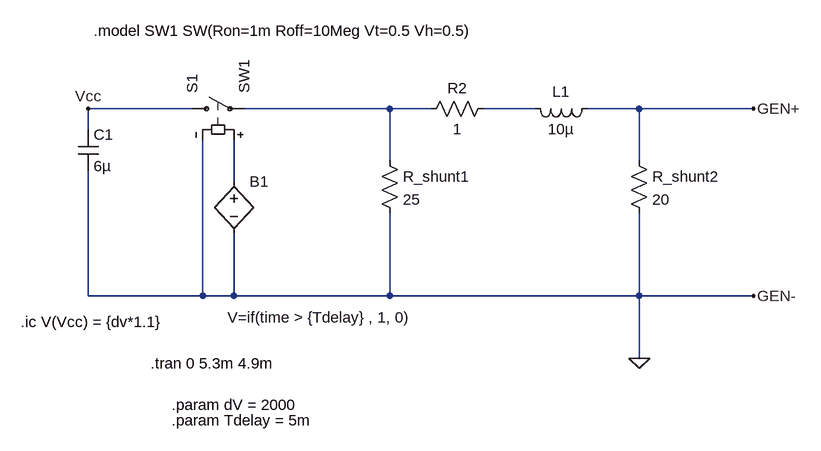
[diagram p0: schematic surge.asc]
surge.asc, the LTspice schematic file:
Version 4
SHEET 1 2304 1216
WIRE 256 64 96 64
WIRE 560 64 336 64
WIRE 624 64 560 64
WIRE 784 64 704 64
WIRE 944 64 864 64
WIRE 1120 64 944 64
WIRE 96 96 96 64
WIRE 560 144 560 64
WIRE 944 144 944 64
WIRE 320 176 320 112
WIRE 96 352 96 160
WIRE 272 352 272 112
WIRE 272 352 96 352
WIRE 320 352 320 256
WIRE 320 352 272 352
WIRE 560 352 560 224
WIRE 560 352 320 352
WIRE 944 352 944 224
WIRE 944 352 560 352
WIRE 1120 352 944 352
WIRE 944 448 944 352
FLAG 96 64 Vcc
FLAG 1120 64 GEN+
FLAG 1120 352 GEN-
FLAG 944 448 0
SYMBOL cap 80 96 R0
SYMATTR InstName C1
SYMATTR Value 6µ
SYMBOL sw 240 64 R270
SYMATTR InstName S1
SYMATTR Value SW1
SYMBOL res 544 128 R0
SYMATTR InstName R_shunt1
SYMATTR Value 25
SYMBOL res 720 48 R90
WINDOW 0 0 56 VBottom 2
WINDOW 3 32 56 VTop 2
SYMATTR InstName R2
SYMATTR Value 1
SYMBOL ind 880 48 R90
WINDOW 0 5 56 VBottom 2
WINDOW 3 32 56 VTop 2
SYMATTR InstName L1
SYMATTR Value 10µ
SYMBOL res 928 128 R0
SYMATTR InstName R_shunt2
SYMATTR Value 20
SYMBOL bv 320 160 R0
WINDOW 3 -10 225 Left 2
SYMATTR InstName B1
SYMATTR Value V=if(time > {Tdelay} , 1, 0)
TEXT 104 -56 Left 2 !.model SW1 SW(Ron=1m Roff=10Meg Vt=0.5 Vh=0.5)
TEXT -8 392 Left 2 !.ic V(Vcc) = {dv*1.1}
TEXT 192 456 Left 2 !.tran 0 5.3m 4.9m
TEXT 224 520 Left 2 !.param dV = 2000
TEXT 224 544 Left 2 !.param Tdelay = 5m

The netlist it stands for:
* surge.asc
C1 Vcc 0 6µ
S1 Vcc N001 N003 0 SW1
R_shunt1 N001 0 25
R2 N002 N001 1
L1 GEN+ N002 10µ
R_shunt2 GEN+ 0 20
B1 N003 0 V=if(time > {Tdelay} , 1, 0)
.model SW1 SW(Ron=1m Roff=10Meg Vt=0.5 Vh=0.5)
.ic V(Vcc) = {dv*1.1}
.tran 0 5.3m 4.9m
.param dV = 2000
.param Tdelay = 5m
.backanno
.end